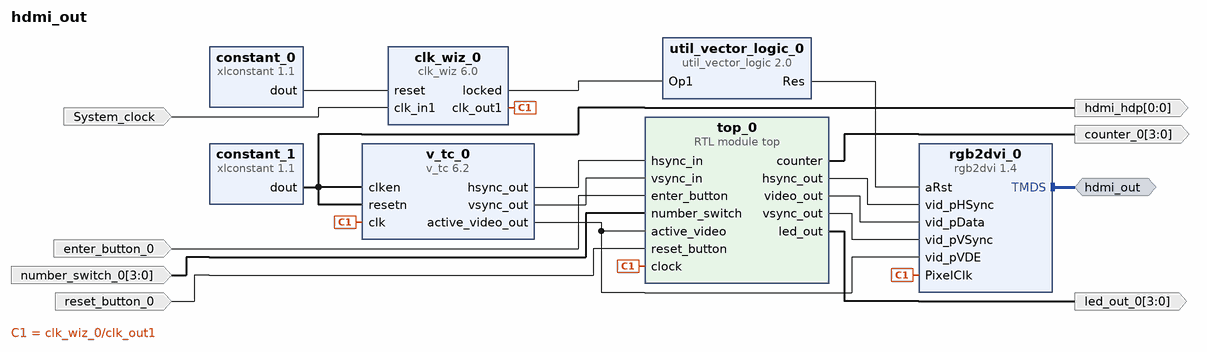
[diagram p0: block diagram of the top level]
# Vivado block design hdmi_out, xc7z020clg400-1, Vivado 2023.2
create_bd_design hdmi_out

create_bd_intf_port -mode Master -vlnv digilentinc.com:interface:tmds_rtl:1.0 hdmi_out
create_bd_port -dir I -type clk System_clock
set_property -dict {CONFIG.FREQ_HZ 125000000} [get_bd_ports System_clock]
create_bd_port -dir O -from 0 -to 0 hdmi_hdp
create_bd_port -dir I enter_button_0
create_bd_port -dir I -type rst reset_button_0
create_bd_port -dir I -from 3 -to 0 number_switch_0
create_bd_port -dir O -from 3 -to 0 counter_0
create_bd_port -dir O -from 3 -to 0 led_out_0

create_bd_cell -type ip -vlnv digilentinc.com:ip:rgb2dvi:1.4 rgb2dvi_0
set_property -dict {CONFIG.kClkRange 3} [get_bd_cells rgb2dvi_0]
create_bd_cell -type ip -vlnv xilinx.com:ip:clk_wiz:6.0 clk_wiz_0
set_property -dict [list \
  CONFIG.CLKOUT1_JITTER 244.188 \
  CONFIG.CLKOUT1_PHASE_ERROR 245.344 \
  CONFIG.CLKOUT1_REQUESTED_OUT_FREQ 74.25 \
  CONFIG.MMCM_CLKFBOUT_MULT_F 37.125 \
  CONFIG.MMCM_CLKOUT0_DIVIDE_F 12.500 \
  CONFIG.MMCM_DIVCLK_DIVIDE 5 \
] [get_bd_cells clk_wiz_0]
create_bd_cell -type ip -vlnv xilinx.com:ip:xlconstant:1.1 constant_0
set_property -dict {CONFIG.CONST_VAL 0} [get_bd_cells constant_0]
create_bd_cell -type ip -vlnv xilinx.com:ip:xlconstant:1.1 constant_1
create_bd_cell -type ip -vlnv xilinx.com:ip:v_tc:6.2 v_tc_0
set_property -dict {CONFIG.HAS_AXI4_LITE false CONFIG.enable_detection false} [get_bd_cells v_tc_0]
create_bd_cell -type module -reference top top_0
create_bd_cell -type ip -vlnv xilinx.com:ip:util_vector_logic:2.0 util_vector_logic_0
set_property -dict {CONFIG.C_OPERATION not CONFIG.C_SIZE 1} [get_bd_cells util_vector_logic_0]

# ---- connections ----

connect_bd_intf_net [get_bd_intf_ports hdmi_out] [get_bd_intf_pins rgb2dvi_0/TMDS]
connect_bd_net [get_bd_ports System_clock] [get_bd_pins clk_wiz_0/clk_in1]
connect_bd_net [get_bd_pins clk_wiz_0/clk_out1] [get_bd_pins rgb2dvi_0/PixelClk] [get_bd_pins v_tc_0/clk] [get_bd_pins top_0/clock]
connect_bd_net [get_bd_pins clk_wiz_0/locked] [get_bd_pins util_vector_logic_0/Op1]
connect_bd_net [get_bd_pins constant_0/dout] [get_bd_pins clk_wiz_0/reset]
connect_bd_net [get_bd_pins constant_1/dout] [get_bd_ports hdmi_hdp] [get_bd_pins v_tc_0/clken] [get_bd_pins v_tc_0/resetn]
connect_bd_net -net enter_button_0_1 [get_bd_ports enter_button_0] [get_bd_pins top_0/enter_button]
connect_bd_net -net number_switch_0_1 [get_bd_ports number_switch_0] [get_bd_pins top_0/number_switch]
connect_bd_net -net reset_button_0_1 [get_bd_ports reset_button_0] [get_bd_pins top_0/reset_button]
connect_bd_net [get_bd_pins top_0/counter] [get_bd_ports counter_0]
connect_bd_net [get_bd_pins top_0/hsync_out] [get_bd_pins rgb2dvi_0/vid_pHSync]
connect_bd_net [get_bd_pins top_0/led_out] [get_bd_ports led_out_0]
connect_bd_net [get_bd_pins top_0/video_out] [get_bd_pins rgb2dvi_0/vid_pData]
connect_bd_net [get_bd_pins top_0/vsync_out] [get_bd_pins rgb2dvi_0/vid_pVSync]
connect_bd_net [get_bd_pins util_vector_logic_0/Res] [get_bd_pins rgb2dvi_0/aRst]
connect_bd_net [get_bd_pins v_tc_0/active_video_out] [get_bd_pins top_0/active_video] [get_bd_pins rgb2dvi_0/vid_pVDE]
connect_bd_net [get_bd_pins v_tc_0/hsync_out] [get_bd_pins top_0/hsync_in]
connect_bd_net [get_bd_pins v_tc_0/vsync_out] [get_bd_pins top_0/vsync_in]

validate_bd_design
save_bd_design
